# EasyEDA schematic SCH_myMCP23017_2023-06-13.json
TITLE: Sheet_1; REV: 1.0; Date: 2023-01-26; Sheet: 1/1; Drawn By: bigjohnson; Company: Your Company
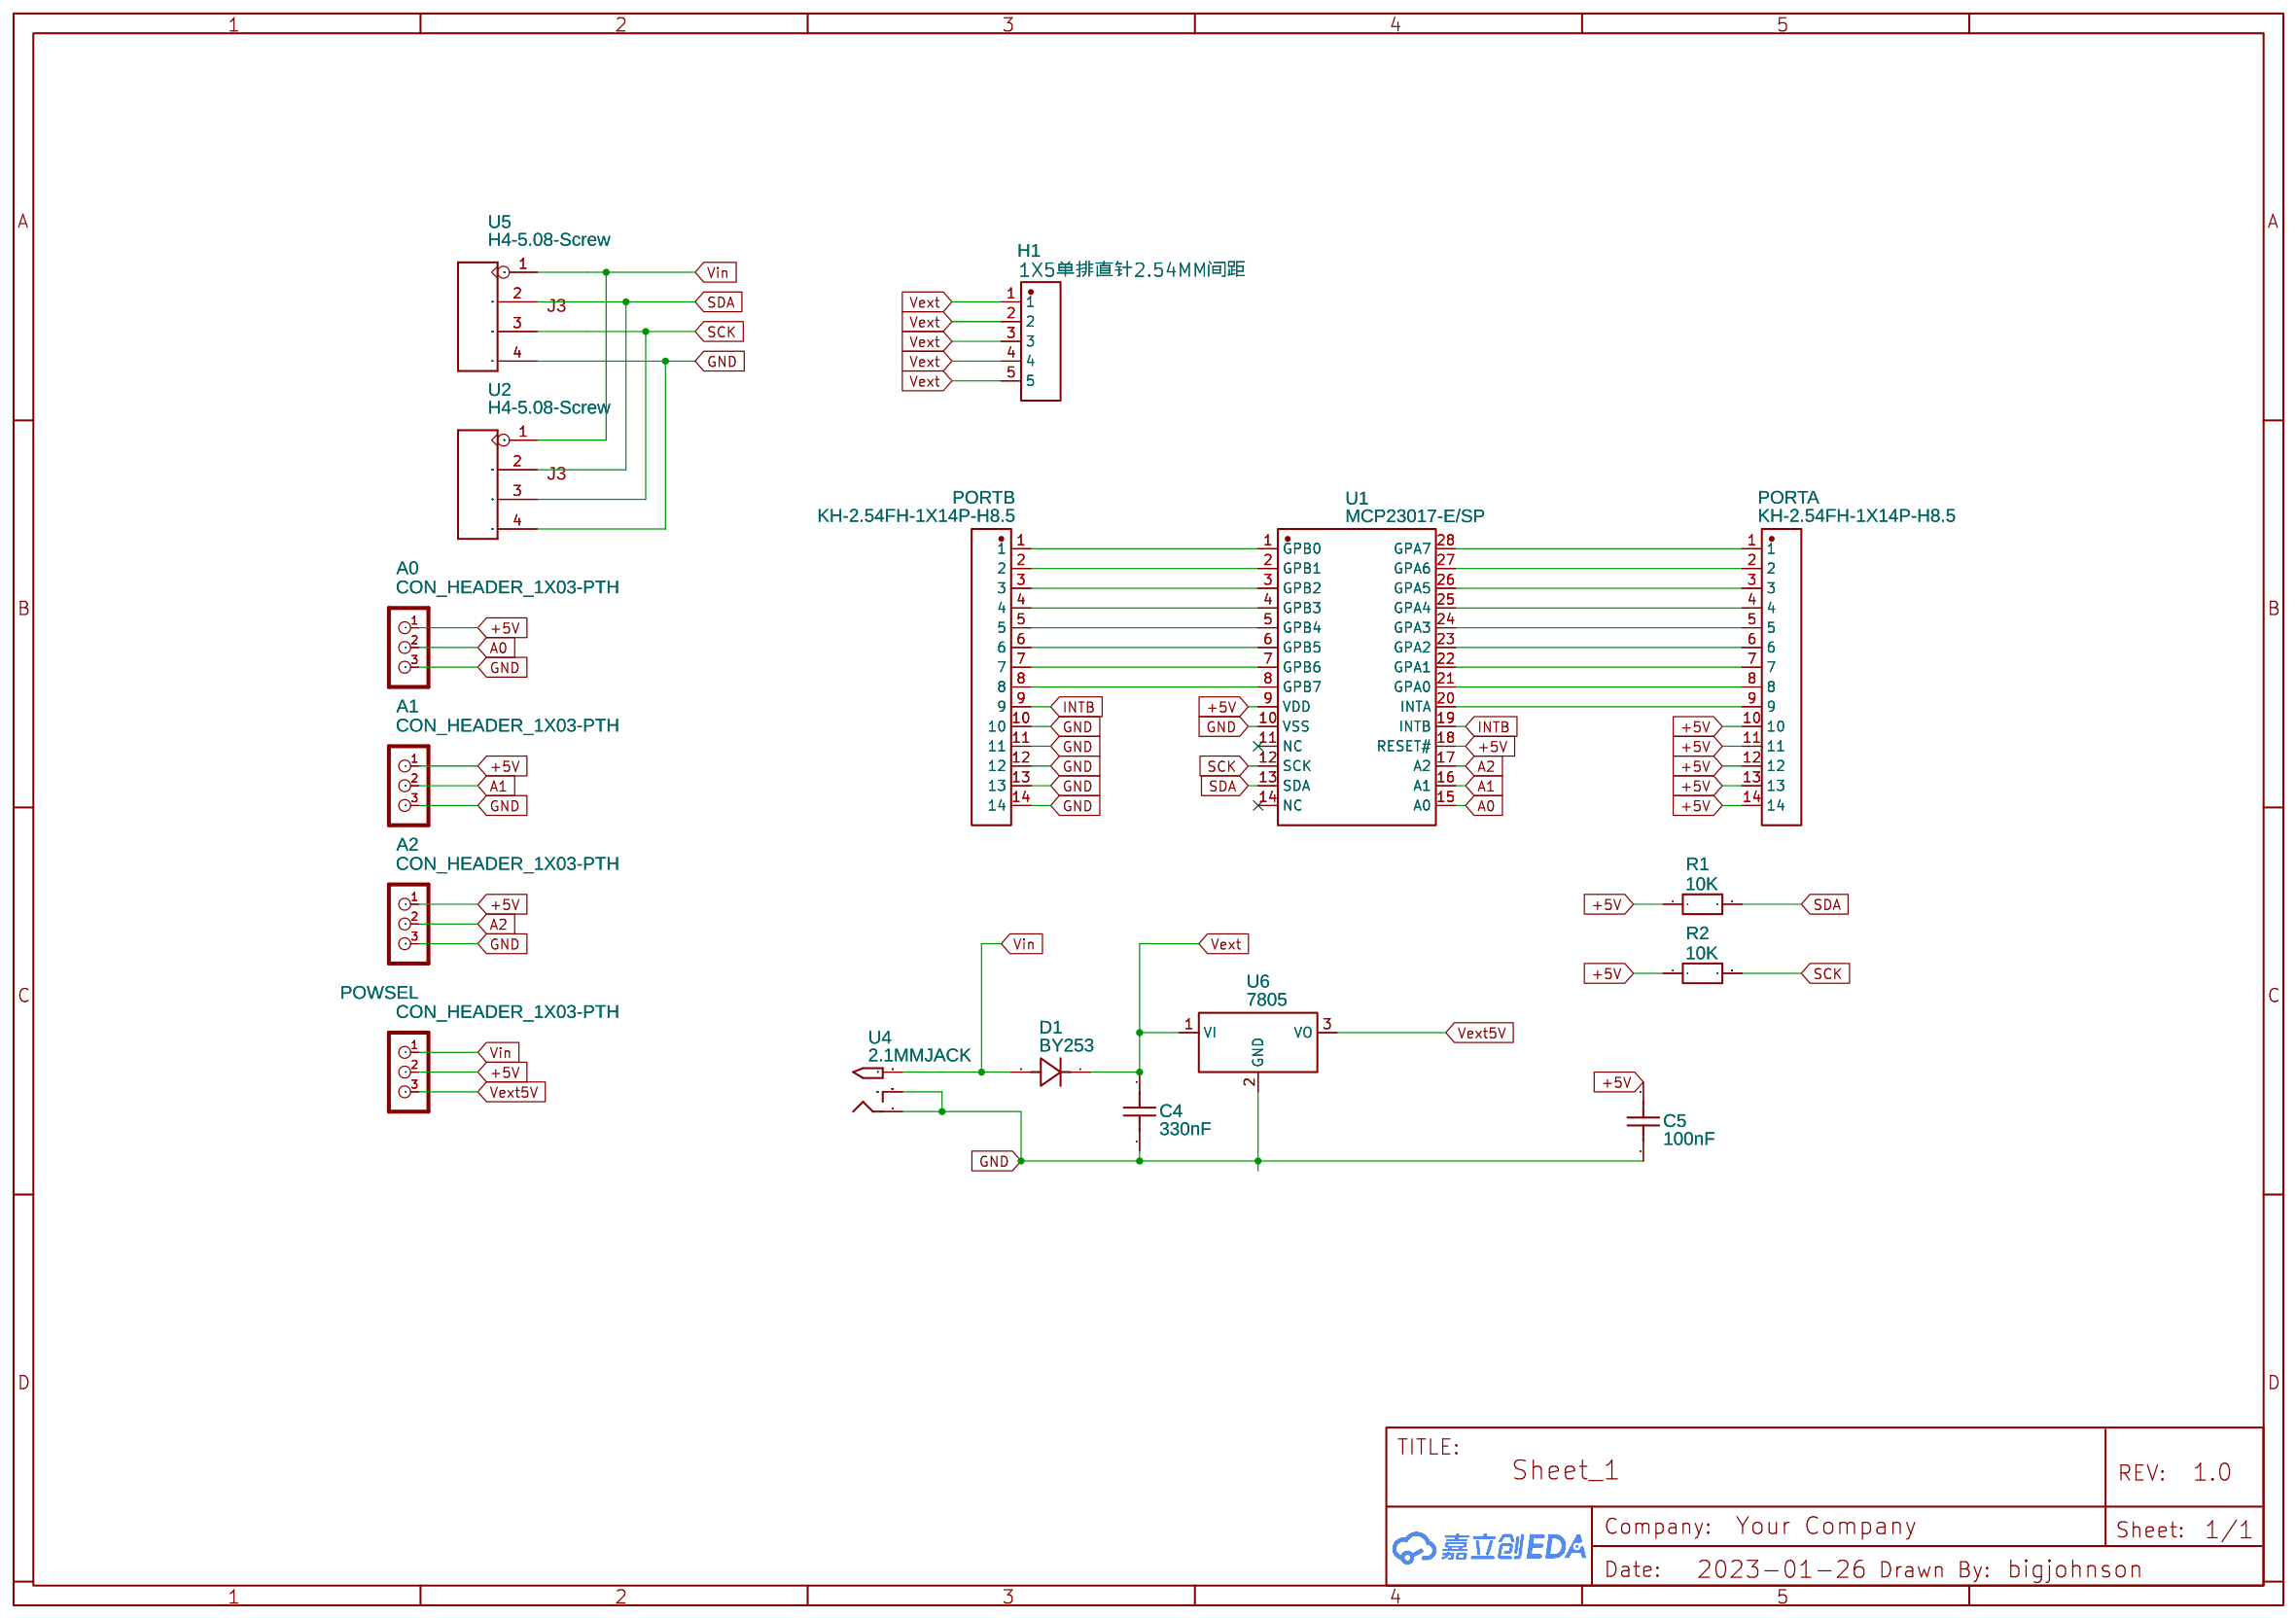
[diagram p0: schematic sheet]

## Parts
A0  CON_HEADER_1X03-PTH  [M1X3]
A1  CON_HEADER_1X03-PTH  [M1X3]
A2  CON_HEADER_1X03-PTH  [M1X3]
C4  330nF  [CAP-TH_L4.2-W3.8-P5.08-D0.6]
C5  100nF  [CAP-TH_L4.2-W3.8-P5.08-D0.6]
D1  BY253  [DO-201_BD5.1-L8.4-P15.24-D1.0-RD]
H1  1X5单排直针2.54MM间距  [HDR-TH_5P-P2.54-V-M]
PORTA  KH-2.54FH-1X14P-H8.5  [HDR-TH_14P-P2.54-V-F]
PORTB  KH-2.54FH-1X14P-H8.5  [HDR-TH_14P-P2.54-V-F]
POWSEL  CON_HEADER_1X03-PTH  [M1X3]
R1  10K  [AXIAL-0.4]
R2  10K  [AXIAL-0.4]
U1  MCP23017-E/SP  [DIP-28_L35.0-W6.5-P2.54-LS7.6-BL]
U2  H4-5.08-Screw  [H4-5.08]
U4  2.1MMJACK  [PJ-102A]
U5  H4-5.08-Screw  [H4-5.08]
U6  7805  [TO-220]

## Library data of the parts
A0-A2 POWSEL = CON_HEADER_1X03-PTH: Contributor: DangerousPrototype
C4 C5 = CT4-0805B103 K500: Supplier: LCSC; Manufacturer: ReliaPro; Supplier Part: C8033
D1 = MUR460_C2990844: Supplier: LCSC; Supplier Part: C2990844; Manufacturer: GOOD-ARK(固锝); Manufacturer Part: MUR460; JLCPCB Part Class: Extended Part; Contributor: lcsc
H1 = 1X5单排直针2.54MM间距: Supplier: LCSC; Supplier Part: C9900017403; Manufacturer: null; Manufacturer Part: 1x5单排直针2.54mm间距; JLCPCB Part Class: Extended Part; Contributor: lcsc
PORTA PORTB = KH-2.54FH-1X14P-H8.5: Supplier: LCSC; Supplier Part: C2905420; Manufacturer: kinghelm(金航标); Contributor: LCSC; JLCPCB Part Class: Extended Part
R1 R2 = Res_AXIAL-0.4(1/4W)_EU
U1 = MCP23017-E/SP: Supplier: LCSC; Supplier Part: C647352; Manufacturer: Microchip Tech; Contributor: LCSC; JLCPCB Part Class: Extended Part
U2 U5 = H4-5.08-Screw: Contributor: Suvuy
U4 = 2.1MMJACK: Contributor: Adafruit
U6 = 7805: Supplier: LCSC; Supplier Part: C305416; Manufacturer: Foshan Blue Rocket Elec; Contributor: Gerardo Trejo-Larin

## Nets
+5V: A0.1 A1.1 A2.1 C5.1 PORTA.10 PORTA.11 PORTA.12 PORTA.13 PORTA.14 POWSEL.2 R1.1 R2.1 U1.9(VDD) U1.18(RESET#)
GND: A0.3 A1.3 A2.3 C4.2 C5.2 PORTB.10 PORTB.11 PORTB.12 PORTB.13 PORTB.14 U1.10(VSS) U2.4(P$4) U4.RING U4.RING_SW U5.4(P$4) U6.2(GND)
Vin: D1.2(A) POWSEL.1 U2.1(P$1) U4.TIP U5.1(P$1)
A0: A0.2 U1.15(A0)
A1: A1.2 U1.16(A1)
A2: A2.2 U1.17(A2)
INTB: PORTB.9 U1.19(INTB)
SCK: R2.2 U1.12(SCK) U2.3(P$3) U5.3(P$3)
SDA: R1.2 U1.13(SDA) U2.2(P$2) U5.2(P$2)
Vext: C4.1 D1.1(K) H1.1 H1.2 H1.3 H1.4 H1.5 U6.1(VI)
Vext5V: POWSEL.3 U6.3(VO)
Net-(PORTA-1): PORTA.1 U1.28(GPA7)
Net-(PORTA-2): PORTA.2 U1.27(GPA6)
Net-(PORTA-3): PORTA.3 U1.26(GPA5)
Net-(PORTA-4): PORTA.4 U1.25(GPA4)
Net-(PORTA-5): PORTA.5 U1.24(GPA3)
Net-(PORTA-6): PORTA.6 U1.23(GPA2)
Net-(PORTA-7): PORTA.7 U1.22(GPA1)
Net-(PORTA-8): PORTA.8 U1.21(GPA0)
Net-(PORTA-9): PORTA.9 U1.20(INTA)
Net-(PORTB-1): PORTB.1 U1.1(GPB0)
Net-(PORTB-2): PORTB.2 U1.2(GPB1)
Net-(PORTB-3): PORTB.3 U1.3(GPB2)
Net-(PORTB-4): PORTB.4 U1.4(GPB3)
Net-(PORTB-5): PORTB.5 U1.5(GPB4)
Net-(PORTB-6): PORTB.6 U1.6(GPB5)
Net-(PORTB-7): PORTB.7 U1.7(GPB6)
Net-(PORTB-8): PORTB.8 U1.8(GPB7)

Not connected (* = marked no-connect by the designer): U1 11(NC)* 14(NC)*
